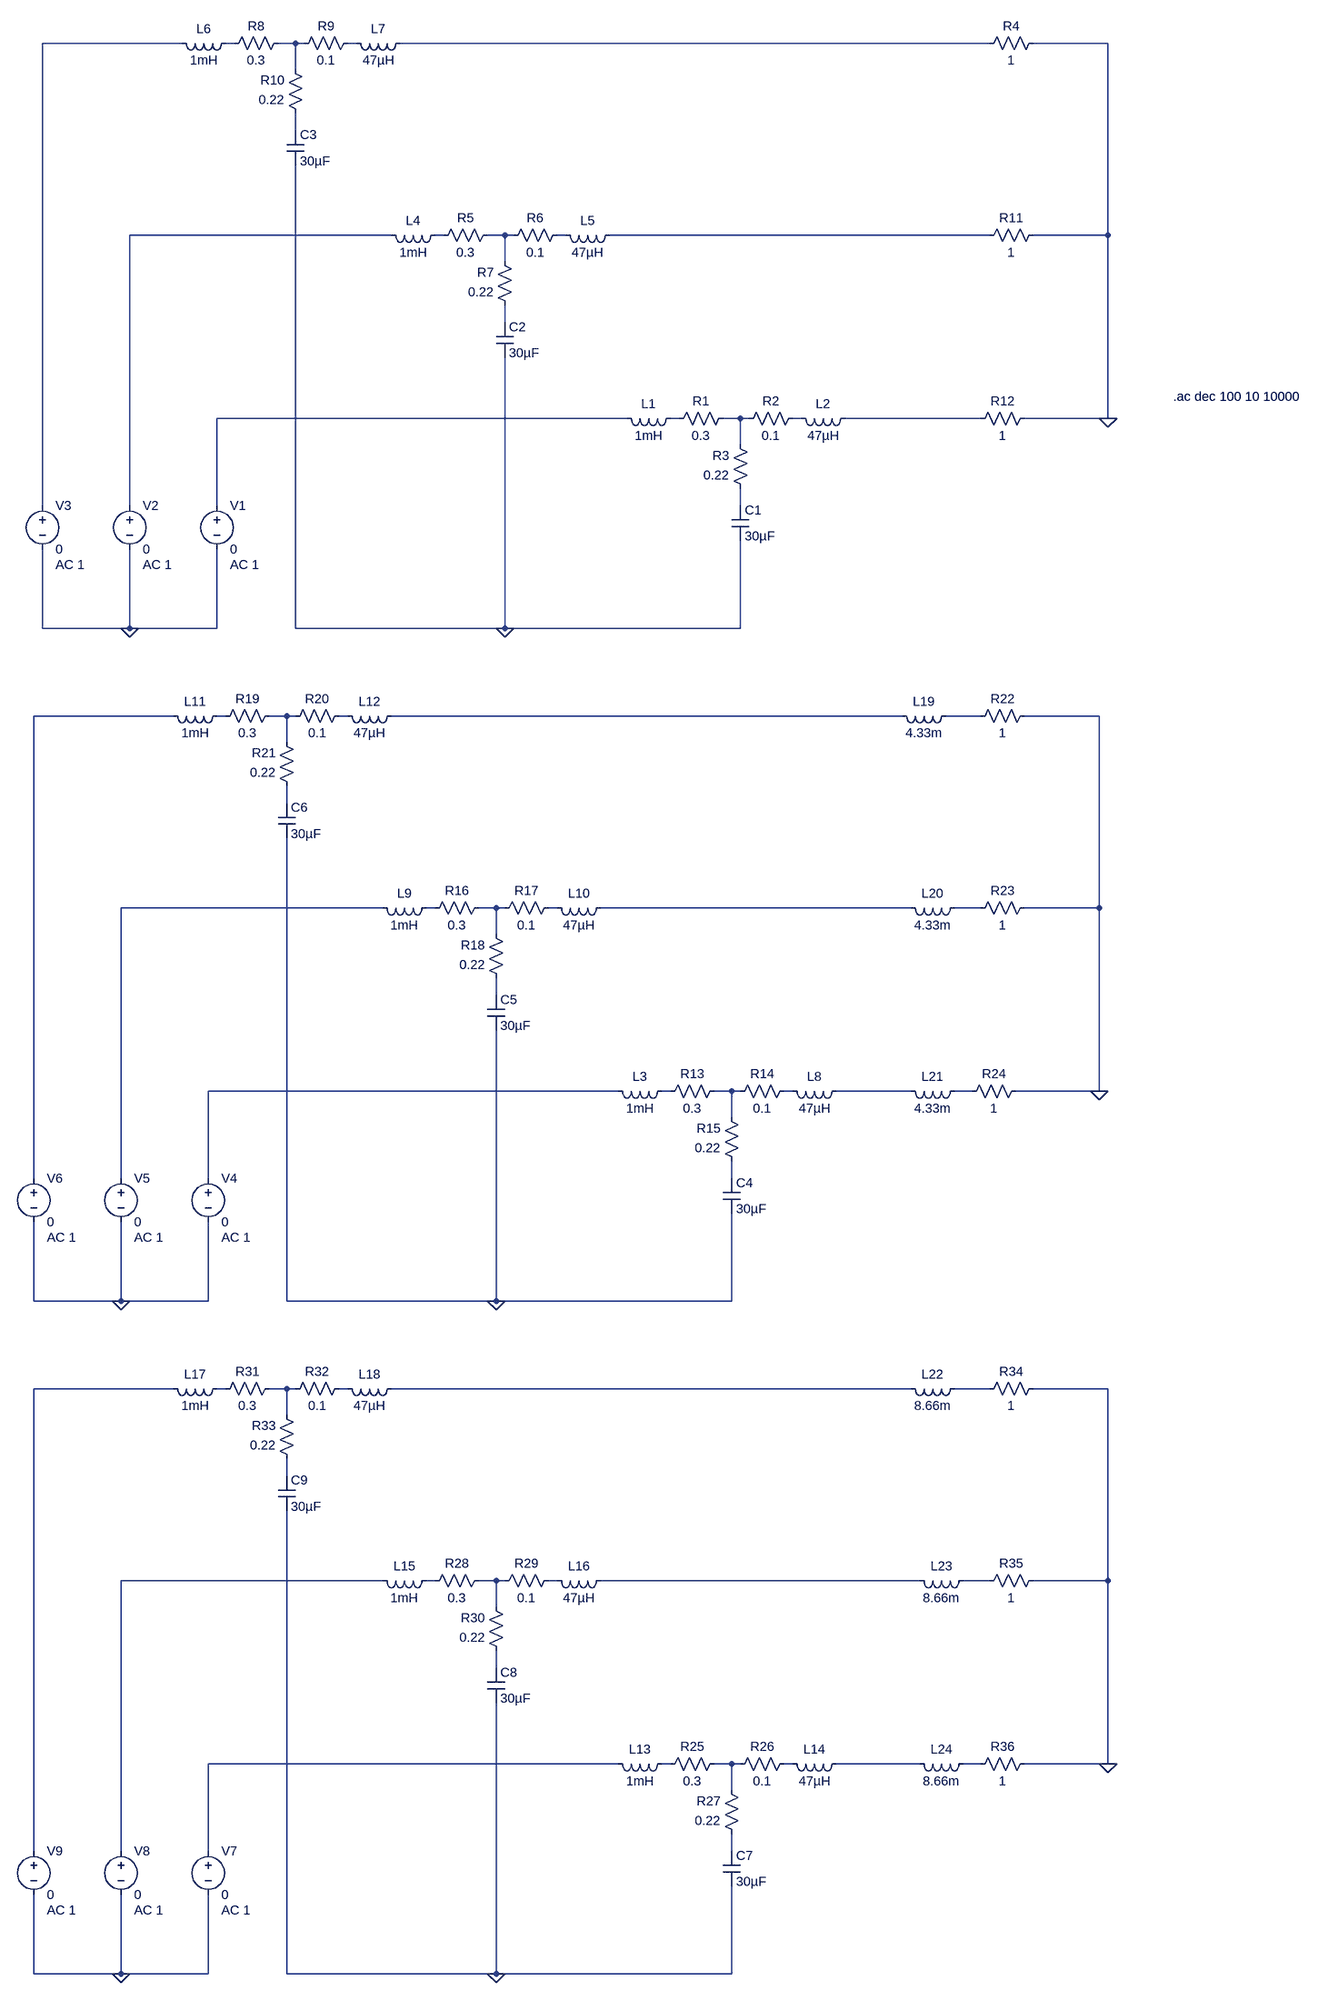
[diagram p0: schematic LCLFilters.asc]
LCLFilters.asc, the LTspice schematic file:
Version 4
SHEET 1 2788 3252
WIRE -256 -576 -512 -576
WIRE -160 -576 -176 -576
WIRE -48 -576 -80 -576
WIRE -32 -576 -48 -576
WIRE 64 -576 48 -576
WIRE 1280 -576 144 -576
WIRE 1504 -576 1360 -576
WIRE -48 -528 -48 -576
WIRE -48 -416 -48 -448
WIRE 128 -224 -352 -224
WIRE 224 -224 208 -224
WIRE 336 -224 304 -224
WIRE 352 -224 336 -224
WIRE 448 -224 432 -224
WIRE 1280 -224 528 -224
WIRE 1504 -224 1504 -576
WIRE 1504 -224 1360 -224
WIRE 336 -176 336 -224
WIRE 336 -64 336 -96
WIRE 560 112 -192 112
WIRE 656 112 640 112
WIRE 768 112 736 112
WIRE 784 112 768 112
WIRE 880 112 864 112
WIRE 1264 112 960 112
WIRE 1504 112 1504 -224
WIRE 1504 112 1344 112
WIRE 768 160 768 112
WIRE -512 272 -512 -576
WIRE -352 272 -352 -224
WIRE -192 272 -192 112
WIRE 768 272 768 240
WIRE -512 512 -512 352
WIRE -352 512 -352 352
WIRE -352 512 -512 512
WIRE -192 512 -192 352
WIRE -192 512 -352 512
WIRE -48 512 -48 -352
WIRE 336 512 336 0
WIRE 336 512 -48 512
WIRE 768 512 768 336
WIRE 768 512 336 512
WIRE -272 784 -528 784
WIRE -176 784 -192 784
WIRE -64 784 -96 784
WIRE -48 784 -64 784
WIRE 48 784 32 784
WIRE 1120 784 128 784
WIRE 1264 784 1200 784
WIRE 1488 784 1344 784
WIRE -64 832 -64 784
WIRE -64 944 -64 912
WIRE 112 1136 -368 1136
WIRE 208 1136 192 1136
WIRE 320 1136 288 1136
WIRE 336 1136 320 1136
WIRE 432 1136 416 1136
WIRE 1136 1136 512 1136
WIRE 1264 1136 1216 1136
WIRE 1488 1136 1488 784
WIRE 1488 1136 1344 1136
WIRE 320 1184 320 1136
WIRE 320 1296 320 1264
WIRE 544 1472 -208 1472
WIRE 640 1472 624 1472
WIRE 752 1472 720 1472
WIRE 768 1472 752 1472
WIRE 864 1472 848 1472
WIRE 1136 1472 944 1472
WIRE 1248 1472 1216 1472
WIRE 1488 1472 1488 1136
WIRE 1488 1472 1328 1472
WIRE 752 1520 752 1472
WIRE -528 1632 -528 784
WIRE -368 1632 -368 1136
WIRE -208 1632 -208 1472
WIRE 752 1632 752 1600
WIRE -528 1872 -528 1712
WIRE -368 1872 -368 1712
WIRE -368 1872 -528 1872
WIRE -208 1872 -208 1712
WIRE -208 1872 -368 1872
WIRE -64 1872 -64 1008
WIRE 320 1872 320 1360
WIRE 320 1872 -64 1872
WIRE 752 1872 752 1696
WIRE 752 1872 320 1872
WIRE -272 2144 -528 2144
WIRE -176 2144 -192 2144
WIRE -64 2144 -96 2144
WIRE -48 2144 -64 2144
WIRE 48 2144 32 2144
WIRE 1136 2144 128 2144
WIRE 1280 2144 1216 2144
WIRE 1504 2144 1360 2144
WIRE -64 2192 -64 2144
WIRE -64 2304 -64 2272
WIRE 112 2496 -368 2496
WIRE 208 2496 192 2496
WIRE 320 2496 288 2496
WIRE 336 2496 320 2496
WIRE 432 2496 416 2496
WIRE 1152 2496 512 2496
WIRE 1280 2496 1232 2496
WIRE 1504 2496 1504 2144
WIRE 1504 2496 1360 2496
WIRE 320 2544 320 2496
WIRE 320 2656 320 2624
WIRE 544 2832 -208 2832
WIRE 640 2832 624 2832
WIRE 752 2832 720 2832
WIRE 768 2832 752 2832
WIRE 864 2832 848 2832
WIRE 1152 2832 944 2832
WIRE 1264 2832 1232 2832
WIRE 1504 2832 1504 2496
WIRE 1504 2832 1344 2832
WIRE 752 2880 752 2832
WIRE -528 2992 -528 2144
WIRE -368 2992 -368 2496
WIRE -208 2992 -208 2832
WIRE 752 2992 752 2960
WIRE -528 3232 -528 3072
WIRE -368 3232 -368 3072
WIRE -368 3232 -528 3232
WIRE -208 3232 -208 3072
WIRE -208 3232 -368 3232
WIRE -64 3232 -64 2368
WIRE 320 3232 320 2720
WIRE 320 3232 -64 3232
WIRE 752 3232 752 3056
WIRE 752 3232 320 3232
FLAG -352 512 0
FLAG 1504 112 0
FLAG 336 512 0
FLAG -368 1872 0
FLAG 1488 1472 0
FLAG 320 1872 0
FLAG -368 3232 0
FLAG 320 3232 0
FLAG 1504 2832 0
SYMBOL ind 656 96 R90
WINDOW 0 5 56 VBottom 2
WINDOW 3 32 56 VTop 2
SYMATTR InstName L1
SYMATTR Value 1mH
SYMBOL ind 976 96 R90
WINDOW 0 5 56 VBottom 2
WINDOW 3 32 56 VTop 2
SYMATTR InstName L2
SYMATTR Value 47µH
SYMBOL res 752 96 R90
WINDOW 0 0 56 VBottom 2
WINDOW 3 32 56 VTop 2
SYMATTR InstName R1
SYMATTR Value 0.3
SYMBOL res 880 96 R90
WINDOW 0 0 56 VBottom 2
WINDOW 3 32 56 VTop 2
SYMATTR InstName R2
SYMATTR Value 0.1
SYMBOL res 784 256 R180
WINDOW 0 36 76 Left 2
WINDOW 3 36 40 Left 2
SYMATTR InstName R3
SYMATTR Value 0.22
SYMBOL cap 752 272 R0
SYMATTR InstName C1
SYMATTR Value 30µF
SYMBOL voltage -192 256 R0
WINDOW 123 24 124 Left 2
WINDOW 39 0 0 Left 0
SYMATTR Value2 AC 1
SYMATTR InstName V1
SYMATTR Value 0
SYMBOL voltage -352 256 R0
WINDOW 123 24 124 Left 2
WINDOW 39 0 0 Left 0
SYMATTR Value2 AC 1
SYMATTR InstName V2
SYMATTR Value 0
SYMBOL voltage -512 256 R0
WINDOW 123 24 124 Left 2
WINDOW 39 0 0 Left 0
SYMATTR Value2 AC 1
SYMATTR InstName V3
SYMATTR Value 0
SYMBOL ind 224 -240 R90
WINDOW 0 5 56 VBottom 2
WINDOW 3 32 56 VTop 2
SYMATTR InstName L4
SYMATTR Value 1mH
SYMBOL ind 544 -240 R90
WINDOW 0 5 56 VBottom 2
WINDOW 3 32 56 VTop 2
SYMATTR InstName L5
SYMATTR Value 47µH
SYMBOL res 320 -240 R90
WINDOW 0 0 56 VBottom 2
WINDOW 3 32 56 VTop 2
SYMATTR InstName R5
SYMATTR Value 0.3
SYMBOL res 448 -240 R90
WINDOW 0 0 56 VBottom 2
WINDOW 3 32 56 VTop 2
SYMATTR InstName R6
SYMATTR Value 0.1
SYMBOL res 352 -80 R180
WINDOW 0 36 76 Left 2
WINDOW 3 36 40 Left 2
SYMATTR InstName R7
SYMATTR Value 0.22
SYMBOL cap 320 -64 R0
SYMATTR InstName C2
SYMATTR Value 30µF
SYMBOL ind -160 -592 R90
WINDOW 0 5 56 VBottom 2
WINDOW 3 32 56 VTop 2
SYMATTR InstName L6
SYMATTR Value 1mH
SYMBOL ind 160 -592 R90
WINDOW 0 5 56 VBottom 2
WINDOW 3 32 56 VTop 2
SYMATTR InstName L7
SYMATTR Value 47µH
SYMBOL res -64 -592 R90
WINDOW 0 0 56 VBottom 2
WINDOW 3 32 56 VTop 2
SYMATTR InstName R8
SYMATTR Value 0.3
SYMBOL res 64 -592 R90
WINDOW 0 0 56 VBottom 2
WINDOW 3 32 56 VTop 2
SYMATTR InstName R9
SYMATTR Value 0.1
SYMBOL res -32 -432 R180
WINDOW 0 36 76 Left 2
WINDOW 3 36 40 Left 2
SYMATTR InstName R10
SYMATTR Value 0.22
SYMBOL cap -64 -416 R0
SYMATTR InstName C3
SYMATTR Value 30µF
SYMBOL res 1376 -592 R90
WINDOW 0 0 56 VBottom 2
WINDOW 3 32 56 VTop 2
SYMATTR InstName R4
SYMATTR Value 1
SYMBOL res 1376 -240 R90
WINDOW 0 0 56 VBottom 2
WINDOW 3 32 56 VTop 2
SYMATTR InstName R11
SYMATTR Value 1
SYMBOL res 1360 96 R90
WINDOW 0 0 56 VBottom 2
WINDOW 3 32 56 VTop 2
SYMATTR InstName R12
SYMATTR Value 1
SYMBOL ind 640 1456 R90
WINDOW 0 5 56 VBottom 2
WINDOW 3 32 56 VTop 2
SYMATTR InstName L3
SYMATTR Value 1mH
SYMBOL ind 960 1456 R90
WINDOW 0 5 56 VBottom 2
WINDOW 3 32 56 VTop 2
SYMATTR InstName L8
SYMATTR Value 47µH
SYMBOL res 736 1456 R90
WINDOW 0 0 56 VBottom 2
WINDOW 3 32 56 VTop 2
SYMATTR InstName R13
SYMATTR Value 0.3
SYMBOL res 864 1456 R90
WINDOW 0 0 56 VBottom 2
WINDOW 3 32 56 VTop 2
SYMATTR InstName R14
SYMATTR Value 0.1
SYMBOL res 768 1616 R180
WINDOW 0 36 76 Left 2
WINDOW 3 36 40 Left 2
SYMATTR InstName R15
SYMATTR Value 0.22
SYMBOL cap 736 1632 R0
SYMATTR InstName C4
SYMATTR Value 30µF
SYMBOL voltage -208 1616 R0
WINDOW 123 24 124 Left 2
WINDOW 39 0 0 Left 0
SYMATTR Value2 AC 1
SYMATTR InstName V4
SYMATTR Value 0
SYMBOL voltage -368 1616 R0
WINDOW 123 24 124 Left 2
WINDOW 39 0 0 Left 0
SYMATTR Value2 AC 1
SYMATTR InstName V5
SYMATTR Value 0
SYMBOL voltage -528 1616 R0
WINDOW 123 24 124 Left 2
WINDOW 39 0 0 Left 0
SYMATTR Value2 AC 1
SYMATTR InstName V6
SYMATTR Value 0
SYMBOL ind 208 1120 R90
WINDOW 0 5 56 VBottom 2
WINDOW 3 32 56 VTop 2
SYMATTR InstName L9
SYMATTR Value 1mH
SYMBOL ind 528 1120 R90
WINDOW 0 5 56 VBottom 2
WINDOW 3 32 56 VTop 2
SYMATTR InstName L10
SYMATTR Value 47µH
SYMBOL res 304 1120 R90
WINDOW 0 0 56 VBottom 2
WINDOW 3 32 56 VTop 2
SYMATTR InstName R16
SYMATTR Value 0.3
SYMBOL res 432 1120 R90
WINDOW 0 0 56 VBottom 2
WINDOW 3 32 56 VTop 2
SYMATTR InstName R17
SYMATTR Value 0.1
SYMBOL res 336 1280 R180
WINDOW 0 36 76 Left 2
WINDOW 3 36 40 Left 2
SYMATTR InstName R18
SYMATTR Value 0.22
SYMBOL cap 304 1296 R0
SYMATTR InstName C5
SYMATTR Value 30µF
SYMBOL ind -176 768 R90
WINDOW 0 5 56 VBottom 2
WINDOW 3 32 56 VTop 2
SYMATTR InstName L11
SYMATTR Value 1mH
SYMBOL ind 144 768 R90
WINDOW 0 5 56 VBottom 2
WINDOW 3 32 56 VTop 2
SYMATTR InstName L12
SYMATTR Value 47µH
SYMBOL res -80 768 R90
WINDOW 0 0 56 VBottom 2
WINDOW 3 32 56 VTop 2
SYMATTR InstName R19
SYMATTR Value 0.3
SYMBOL res 48 768 R90
WINDOW 0 0 56 VBottom 2
WINDOW 3 32 56 VTop 2
SYMATTR InstName R20
SYMATTR Value 0.1
SYMBOL res -48 928 R180
WINDOW 0 36 76 Left 2
WINDOW 3 36 40 Left 2
SYMATTR InstName R21
SYMATTR Value 0.22
SYMBOL cap -80 944 R0
SYMATTR InstName C6
SYMATTR Value 30µF
SYMBOL res 1360 768 R90
WINDOW 0 0 56 VBottom 2
WINDOW 3 32 56 VTop 2
SYMATTR InstName R22
SYMATTR Value 1
SYMBOL res 1360 1120 R90
WINDOW 0 0 56 VBottom 2
WINDOW 3 32 56 VTop 2
SYMATTR InstName R23
SYMATTR Value 1
SYMBOL res 1344 1456 R90
WINDOW 0 0 56 VBottom 2
WINDOW 3 32 56 VTop 2
SYMATTR InstName R24
SYMATTR Value 1
SYMBOL ind 640 2816 R90
WINDOW 0 5 56 VBottom 2
WINDOW 3 32 56 VTop 2
SYMATTR InstName L13
SYMATTR Value 1mH
SYMBOL ind 960 2816 R90
WINDOW 0 5 56 VBottom 2
WINDOW 3 32 56 VTop 2
SYMATTR InstName L14
SYMATTR Value 47µH
SYMBOL res 736 2816 R90
WINDOW 0 0 56 VBottom 2
WINDOW 3 32 56 VTop 2
SYMATTR InstName R25
SYMATTR Value 0.3
SYMBOL res 864 2816 R90
WINDOW 0 0 56 VBottom 2
WINDOW 3 32 56 VTop 2
SYMATTR InstName R26
SYMATTR Value 0.1
SYMBOL res 768 2976 R180
WINDOW 0 36 76 Left 2
WINDOW 3 36 40 Left 2
SYMATTR InstName R27
SYMATTR Value 0.22
SYMBOL cap 736 2992 R0
SYMATTR InstName C7
SYMATTR Value 30µF
SYMBOL voltage -208 2976 R0
WINDOW 123 24 124 Left 2
WINDOW 39 0 0 Left 0
SYMATTR Value2 AC 1
SYMATTR InstName V7
SYMATTR Value 0
SYMBOL voltage -368 2976 R0
WINDOW 123 24 124 Left 2
WINDOW 39 0 0 Left 0
SYMATTR Value2 AC 1
SYMATTR InstName V8
SYMATTR Value 0
SYMBOL voltage -528 2976 R0
WINDOW 123 24 124 Left 2
WINDOW 39 0 0 Left 0
SYMATTR Value2 AC 1
SYMATTR InstName V9
SYMATTR Value 0
SYMBOL ind 208 2480 R90
WINDOW 0 5 56 VBottom 2
WINDOW 3 32 56 VTop 2
SYMATTR InstName L15
SYMATTR Value 1mH
SYMBOL ind 528 2480 R90
WINDOW 0 5 56 VBottom 2
WINDOW 3 32 56 VTop 2
SYMATTR InstName L16
SYMATTR Value 47µH
SYMBOL res 304 2480 R90
WINDOW 0 0 56 VBottom 2
WINDOW 3 32 56 VTop 2
SYMATTR InstName R28
SYMATTR Value 0.3
SYMBOL res 432 2480 R90
WINDOW 0 0 56 VBottom 2
WINDOW 3 32 56 VTop 2
SYMATTR InstName R29
SYMATTR Value 0.1
SYMBOL res 336 2640 R180
WINDOW 0 36 76 Left 2
WINDOW 3 36 40 Left 2
SYMATTR InstName R30
SYMATTR Value 0.22
SYMBOL cap 304 2656 R0
SYMATTR InstName C8
SYMATTR Value 30µF
SYMBOL ind -176 2128 R90
WINDOW 0 5 56 VBottom 2
WINDOW 3 32 56 VTop 2
SYMATTR InstName L17
SYMATTR Value 1mH
SYMBOL ind 144 2128 R90
WINDOW 0 5 56 VBottom 2
WINDOW 3 32 56 VTop 2
SYMATTR InstName L18
SYMATTR Value 47µH
SYMBOL res -80 2128 R90
WINDOW 0 0 56 VBottom 2
WINDOW 3 32 56 VTop 2
SYMATTR InstName R31
SYMATTR Value 0.3
SYMBOL res 48 2128 R90
WINDOW 0 0 56 VBottom 2
WINDOW 3 32 56 VTop 2
SYMATTR InstName R32
SYMATTR Value 0.1
SYMBOL res -48 2288 R180
WINDOW 0 36 76 Left 2
WINDOW 3 36 40 Left 2
SYMATTR InstName R33
SYMATTR Value 0.22
SYMBOL cap -80 2304 R0
SYMATTR InstName C9
SYMATTR Value 30µF
SYMBOL ind 1216 768 R90
WINDOW 0 5 56 VBottom 2
WINDOW 3 32 56 VTop 2
SYMATTR InstName L19
SYMATTR Value 4.33m
SYMBOL ind 1232 1120 R90
WINDOW 0 5 56 VBottom 2
WINDOW 3 32 56 VTop 2
SYMATTR InstName L20
SYMATTR Value 4.33m
SYMBOL ind 1232 1456 R90
WINDOW 0 5 56 VBottom 2
WINDOW 3 32 56 VTop 2
SYMATTR InstName L21
SYMATTR Value 4.33m
SYMBOL res 1376 2128 R90
WINDOW 0 0 56 VBottom 2
WINDOW 3 32 56 VTop 2
SYMATTR InstName R34
SYMATTR Value 1
SYMBOL res 1376 2480 R90
WINDOW 0 0 56 VBottom 2
WINDOW 3 32 56 VTop 2
SYMATTR InstName R35
SYMATTR Value 1
SYMBOL res 1360 2816 R90
WINDOW 0 0 56 VBottom 2
WINDOW 3 32 56 VTop 2
SYMATTR InstName R36
SYMATTR Value 1
SYMBOL ind 1232 2128 R90
WINDOW 0 5 56 VBottom 2
WINDOW 3 32 56 VTop 2
SYMATTR InstName L22
SYMATTR Value 8.66m
SYMBOL ind 1248 2480 R90
WINDOW 0 5 56 VBottom 2
WINDOW 3 32 56 VTop 2
SYMATTR InstName L23
SYMATTR Value 8.66m
SYMBOL ind 1248 2816 R90
WINDOW 0 5 56 VBottom 2
WINDOW 3 32 56 VTop 2
SYMATTR InstName L24
SYMATTR Value 8.66m
TEXT 1784 72 Left 2 !.ac dec 100 10 10000

The netlist it stands for:
* LCLFilters.asc
L1 N014 N013 1mH
L2 N017 N016 47µH
R1 N015 N014 0.3
R2 N016 N015 0.1
R3 N018 N015 0.22
C1 N018 0 30µF
V1 N013 0 0 AC 1
V2 N007 0 0 AC 1
V3 N001 0 0 AC 1
L4 N008 N007 1mH
L5 N011 N010 47µH
R5 N009 N008 0.3
R6 N010 N009 0.1
R7 N012 N009 0.22
C2 N012 0 30µF
L6 N002 N001 1mH
L7 N005 N004 47µH
R8 N003 N002 0.3
R9 N004 N003 0.1
R10 N006 N003 0.22
C3 N006 0 30µF
R4 0 N005 1
R11 0 N011 1
R12 0 N017 1
L3 N034 N033 1mH
L8 N037 N036 47µH
R13 N035 N034 0.3
R14 N036 N035 0.1
R15 N039 N035 0.22
C4 N039 0 30µF
V4 N033 0 0 AC 1
V5 N026 0 0 AC 1
V6 N019 0 0 AC 1
L9 N027 N026 1mH
L10 N030 N029 47µH
R16 N028 N027 0.3
R17 N029 N028 0.1
R18 N032 N028 0.22
C5 N032 0 30µF
L11 N020 N019 1mH
L12 N023 N022 47µH
R19 N021 N020 0.3
R20 N022 N021 0.1
R21 N025 N021 0.22
C6 N025 0 30µF
R22 0 N024 1
R23 0 N031 1
R24 0 N038 1
L13 N055 N054 1mH
L14 N058 N057 47µH
R25 N056 N055 0.3
R26 N057 N056 0.1
R27 N060 N056 0.22
C7 N060 0 30µF
V7 N054 0 0 AC 1
V8 N047 0 0 AC 1
V9 N040 0 0 AC 1
L15 N048 N047 1mH
L16 N051 N050 47µH
R28 N049 N048 0.3
R29 N050 N049 0.1
R30 N053 N049 0.22
C8 N053 0 30µF
L17 N041 N040 1mH
L18 N044 N043 47µH
R31 N042 N041 0.3
R32 N043 N042 0.1
R33 N046 N042 0.22
C9 N046 0 30µF
L19 N024 N023 4.33m
L20 N031 N030 4.33m
L21 N038 N037 4.33m
R34 0 N045 1
R35 0 N052 1
R36 0 N059 1
L22 N045 N044 8.66m
L23 N052 N051 8.66m
L24 N059 N058 8.66m
.ac dec 100 10 10000
.backanno
.end